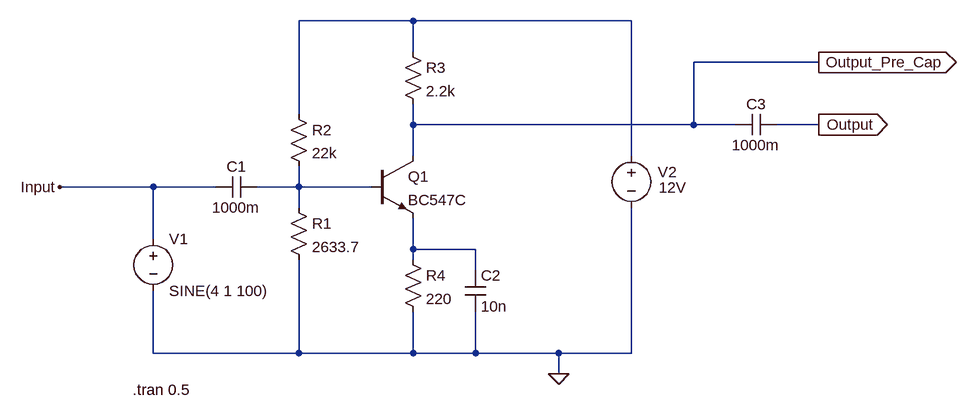
[diagram p0: schematic electronics_common_emitter_amplifier.asc]
electronics_common_emitter_amplifier.asc, the LTspice schematic file:
Version 4
SHEET 1 1292 680
WIRE 416 -160 240 -160
WIRE 752 -160 416 -160
WIRE 416 -112 416 -160
WIRE 1040 -96 848 -96
WIRE 240 -16 240 -160
WIRE 416 0 416 -32
WIRE 848 0 848 -96
WIRE 848 0 416 0
WIRE 912 0 848 0
WIRE 1040 0 976 0
WIRE 416 48 416 0
WIRE 752 48 752 -160
WIRE 16 96 -128 96
WIRE 112 96 16 96
WIRE 240 96 240 64
WIRE 240 96 176 96
WIRE 352 96 240 96
WIRE 240 128 240 96
WIRE 16 176 16 96
WIRE 416 192 416 144
WIRE 512 192 416 192
WIRE 416 208 416 192
WIRE 512 224 512 192
WIRE 16 352 16 256
WIRE 240 352 240 208
WIRE 240 352 16 352
WIRE 416 352 416 288
WIRE 416 352 240 352
WIRE 512 352 512 288
WIRE 512 352 416 352
WIRE 640 352 512 352
WIRE 752 352 752 128
WIRE 752 352 640 352
WIRE 640 384 640 352
FLAG 1040 0 Output
IOPIN 1040 0 Out
FLAG 640 384 0
FLAG -128 96 Input
FLAG 1040 -96 Output_Pre_Cap
IOPIN 1040 -96 Out
SYMBOL voltage 16 160 R0
WINDOW 123 0 0 Left 0
WINDOW 39 0 0 Left 0
SYMATTR InstName V1
SYMATTR Value SINE(4 1 100)
SYMBOL cap 176 80 R90
WINDOW 0 0 32 VBottom 2
WINDOW 3 32 32 VTop 2
SYMATTR InstName C1
SYMATTR Value 1000m
SYMBOL res 224 112 R0
SYMATTR InstName R1
SYMATTR Value 2633.7
SYMBOL res 224 -32 R0
SYMATTR InstName R2
SYMATTR Value 22k
SYMBOL npn 352 48 R0
SYMATTR InstName Q1
SYMATTR Value BC547C
SYMBOL res 400 -128 R0
SYMATTR InstName R3
SYMATTR Value 2.2k
SYMBOL res 400 192 R0
SYMATTR InstName R4
SYMATTR Value 220
SYMBOL cap 496 224 R0
SYMATTR InstName C2
SYMATTR Value 10n
SYMBOL cap 976 -16 R90
WINDOW 0 0 32 VBottom 2
WINDOW 3 32 32 VTop 2
SYMATTR InstName C3
SYMATTR Value 1000m
SYMBOL voltage 752 32 R0
WINDOW 0 41 41 Left 2
WINDOW 3 42 65 Left 2
WINDOW 123 0 0 Left 0
WINDOW 39 0 0 Left 0
SYMATTR InstName V2
SYMATTR Value 12V
TEXT -16 408 Left 2 !.tran 0.5

The netlist it stands for:
* electronics_common_emitter_amplifier.asc
V1 Input 0 SINE(4 1 100)
C1 N002 Input 1000m
R1 N002 0 2633.7
R2 N001 N002 22k
Q1 Output_Pre_Cap N002 N003 0 BC547C
R3 N001 Output_Pre_Cap 2.2k
R4 N003 0 220
C2 N003 0 10n
C3 Output Output_Pre_Cap 1000m
V2 N001 0 12V
.model NPN NPN
.model PNP PNP
.lib standard.bjt
.tran 0.5
.backanno
.end